# EAGLE design OmneticsAdaptorDoubleHeadstage (EAGLE 7.6.0)
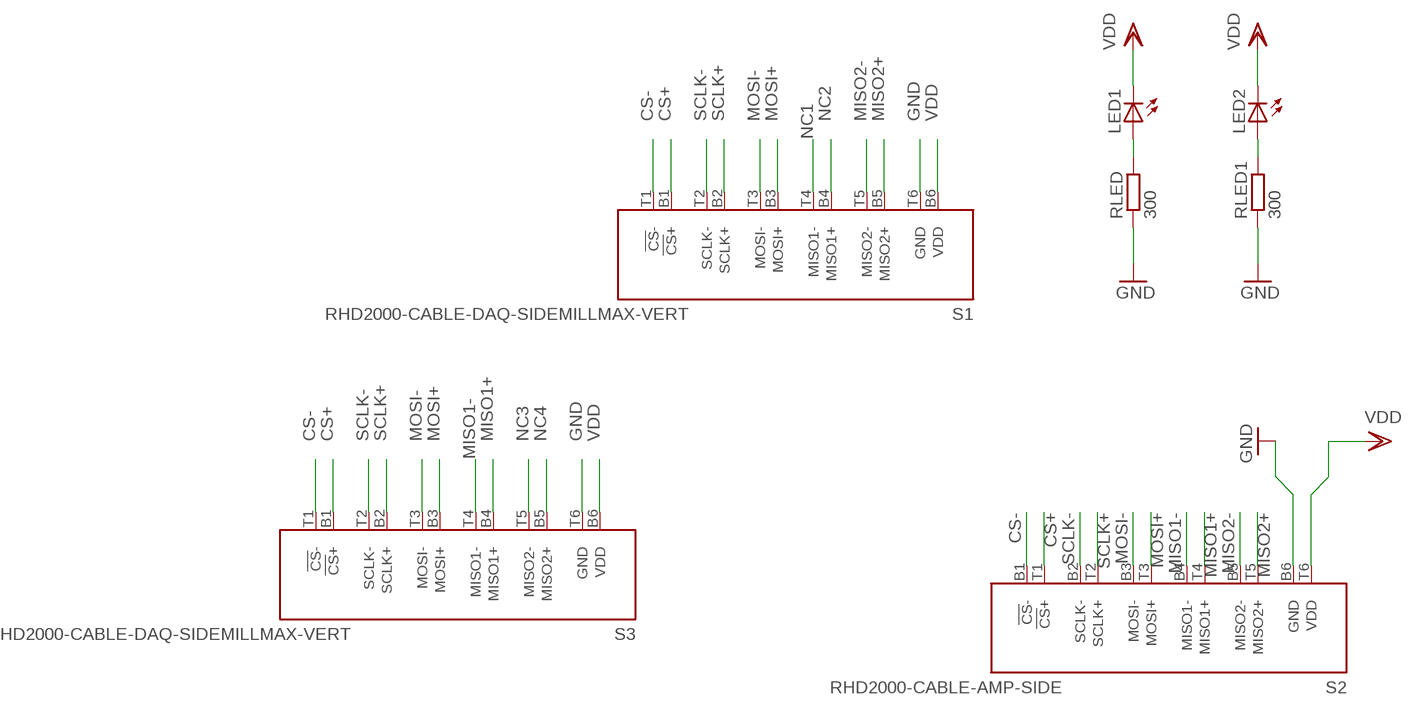
[diagram p0: schematic, sheet 1]

## Parts
LED1  LEDCHIPLED_0805  [CHIPLED_0805]
LED2  LEDCHIPLED_0805  [CHIPLED_0805]
RLED  300  R-EU_R0402  [R0402]
RLED1  300  R-EU_R0402  [R0402]
S1  RHD2000-CABLE-DAQ-SIDEMILLMAX-VERT  [MILLMAX-12PIN-VERT]
S2  RHD2000-CABLE-AMP-SIDE  [OMNETICS_PZN-12-AA]
S3  RHD2000-CABLE-DAQ-SIDEMILLMAX-VERT  [MILLMAX-12PIN-VERT]

## Nets
CS+: S1.B1(!CS!+) S2.T1(!CS!+) S3.B1(!CS!+)
CS-: S1.T1(!CS!-) S2.B1(!CS!-) S3.T1(!CS!-)
GND: RLED1.1 RLED.1 S1.T6(GND) S2.B6(GND) S3.T6(GND)
LEDOUT: LED1.A RLED.2
LEDOUT1: LED2.A RLED1.2
MISO1+: S2.T4(MISO1+) S3.B4(MISO1+)
MISO1-: S2.B4(MISO1-) S3.T4(MISO1-)
MISO2+: S1.B5(MISO2+) S2.T5(MISO2+)
MISO2-: S1.T5(MISO2-) S2.B5(MISO2-)
MOSI+: S1.B3(MOSI+) S2.T3(MOSI+) S3.B3(MOSI+)
MOSI-: S1.T3(MOSI-) S2.B3(MOSI-) S3.T3(MOSI-)
NC1: S1.T4(MISO1-)
NC2: S1.B4(MISO1+)
NC3: S3.T5(MISO2-)
NC4: S3.B5(MISO2+)
SCLK+: S1.B2(SCLK+) S2.T2(SCLK+) S3.B2(SCLK+)
SCLK-: S1.T2(SCLK-) S2.B2(SCLK-) S3.T2(SCLK-)
VDD: LED1.C LED2.C S1.B6(VDD) S2.T6(VDD) S3.B6(VDD)

## Library data of the parts
LED1 LED2 = led:LED: LED OSRAM: - CHIPLED LG R971, LG N971, LY N971, LG Q971, LY Q971, LO R971, LY R971 LH N974, LH R974 LS Q976, LO Q976, LY Q976 LO Q996 - Hyper CHIPLED LW Q18S LB Q993, LB Q99A, LB R99A - SideLED LS A670, LO A670, LY A670, LG A670, LP A670 LB A673, LV A673, LT A673, LW A673 LH A674 LY A675 LS A676, LA A676, LO A676, LY A676, LW A676 LS A679, LY A679, LG A679 - Hyper Micro SIDELED® LS Y876, LA Y876, LO Y876, LY Y876 LT Y87S - SmartLED LW L88C, LW L88S LB L89C, LB L89S, LG L890 LS L89K, LO L89K, LY L89K LS L896, LA L896, LO L896, LY L896 - TOPLED LS T670, LO T670, LY T670, LG T670, LP T670 LSG T670, LSP T670, LSY T670, LOP T670, LYG T670 LG T671, LOG T671, LSG T671 LB T673, LV T673, LT T673, LW T673 LH T674 LS T676, LA T676, LO T676, LY T676, LB T676, LH T676, LSB T676, LW T676 LB T67C, LV T67C, LT T67C, LS T67K, LO T67K, LY T67K, LW E67C LS E67B, LA E67B, LO E67B, LY E67B, LB E67C, LV E67C, LT E67C LW T67C LS T679, LY T679, LG T679 LS T770, LO T770, LY T770, LG T770, LP T770 LB T773, LV T773, LT T773, LW T773 LH T774 LS E675, LA E675, LY E675, LS T675 LS T776, LA T776, LO T776, LY T776, LB T776 LHGB T686 LT T68C, LB T68C - Hyper Mini TOPLED® LB M676 - Mini TOPLED Santana® LG M470 LS M47K, LO M47K, LY M47K Source: http://www.osram.convergy.de LUXEON: - LUMILED® LXK2-PW12-R00, LXK2-PW12-S00, LXK2-PW14-U00, LXK2-PW14-V00 LXK2-PM12-R00, LXK2-PM12-S00, LXK2-PM14-U00 LXK2-PE12-Q00, LXK2-PE12-R00, LXK2-PE12-S00, LXK2-PE14-T00, LXK2-PE14-U00 LXK2-PB12-K00, LXK2-PB12-L00, LXK2-PB12-M00, LXK2-PB14-N00, LXK2-PB14-P00, LXK2-PB14-Q00 LXK2-PR12-L00, LXK2-PR12-M00, LXK2-PR14-Q00, LXK2-PR14-R00 LXK2-PD12-Q00, LXK2-PD12-R00, LXK2-PD12-S00 LXK2-PH12-R00, LXK2-PH12-S00 LXK2-PL12-P00, LXK2-PL12-Q00, LXK2-PL12-R00 Source: www.luxeon.com KINGBRIGHT: KA-3528ASYC Source: www.kingbright.com
RLED RLED1 = resistor:R-EU_: RESISTOR, European symbol
S1 S3 = RHD2000:RHD2000-CABLE-DAQ-SIDE: Omnetics A79623 PZN-12-AA connector for SPI interface (controller side)
S2 = headstage:RHD2000-CABLE-AMP-SIDE

## Board
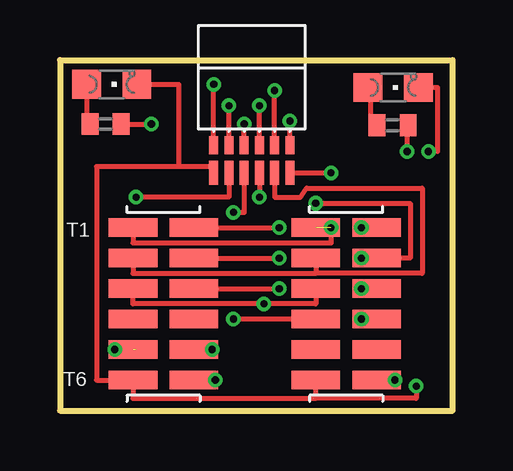
[diagram p1: board, top side]
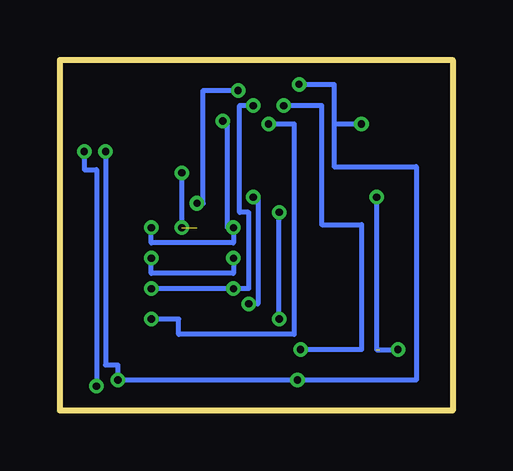
[diagram p2: board, bottom side, seen from below]

Size 16.38 x 14.61 mm. Coordinates in mm from the lower left corner, seen from the top.
Outline: 0,14.61 0,0 16.38,0 16.38,14.61 0,14.61
Copper layers (1*16): Top 0.035mm / dielectric 1.5mm / Bottom 0.035mm
Design rules "Fusion_eagle_rule_v1.1 *": minimum track width 6mil, minimum drill 0.3mm, track to track 6mil, track to pad 6mil, pad to pad 6mil, via to via 6mil, smd to smd 0mil, copper to edge 10mil, drill to drill 10mil, minimum pad ring 10mil, minimum via ring 6mil, stop-mask expansion 2mil, vias tented up to drill 100mil, thermal gap 10mil

### Footprints (pad centres in the part's own frame; a part is rotated, then mirrored left to right if it is on the bottom)
CHIPLED_0805 = smd 1.2 x 1.2: A 0,-1.05; C 0,1.05
R0402 = smd 0.7 x 0.9: 1 -0.65,0; 2 0.65,0
MILLMAX-12PIN-VERT = smd 0.762 x 2.032: B1 3.175,1.27; B2 1.905,1.27; B3 0.635,1.27; B4 -0.635,1.27; B5 -1.905,1.27; B6 -3.175,1.27; T1 3.175,-1.27; T2 1.905,-1.27; T3 0.635,-1.27; T4 -0.635,-1.27; T5 -1.905,-1.27; T6 -3.175,-1.27
OMNETICS_PZN-12-AA = smd 0.381 x 0.762: B1 1.587,-1.016; B2 0.953,-1.016; B3 0.318,-1.016; B4 -0.318,-1.016; B5 -0.953,-1.016; B6 -1.587,-1.016 | smd 0.381 x 1.016: T1 1.587,-2.159; T2 0.953,-2.159; T3 0.318,-2.159; T4 -0.318,-2.159; T5 -0.953,-2.159; T6 -1.587,-2.159

### Placement (x,y rotation side)
LED1  13.89,13.46 270 top
LED2  2.16,13.59 270 top
RLED  13.87,11.89 180 top
RLED1  1.91,11.94 180 top
S1  4.32,4.45 90 top
S2  8,12.06 0 top
S3  11.94,4.45 90 top

### Tracks (layer width: path | path; a pad name or v marks a point on that pad's centre or on a via)
CS+  (via drill 0.3)  (1 unrouted)
  Top 0.203: S1.B1 3.05,6.99 11.3,6.99 v11.3,7.62 | S2.T1 v11.3,9.91
  Bottom 0.203: v11.3,9.91 v11.3,7.62
CS-  (via drill 0.3)
  Top 0.203: S1.T1 v9.14,7.62 | v12.57,7.62 S3.T1 | S2.B1 v9.59,12.06
  Bottom 0.203: v12.57,7.62 12.57,6.99 9.14,6.99 v9.14,7.62 9.4,7.62 9.4,12.06 v9.59,12.06
GND  (via drill 0.3)
  Top 0.203: RLED1.1 v3.81,11.94 | S1.T6 v6.48,1.27 | v13.97,1.27 S3.T6 | RLED.1 14.48,11.89 v14.48,10.79 | S2.B6 v6.41,13.59
  Bottom 0.203: v3.81,11.94 4.95,11.94 | 4.95,11.94 4.95,10.16 1.52,10.16 1.52,1.27 v6.48,1.27 v13.97,1.27 13.97,1.91 14.48,1.91 v14.48,10.79 | v6.41,13.59 4.95,13.59 4.95,11.94
LEDOUT
  Top 0.203: LED1.A 12.95,13.46 12.95,11.89 RLED.2
LEDOUT1
  Top 0.203: LED2.A 1.11,11.94 RLED1.2
MISO1+  (via drill 0.3)
  Top 0.203: S2.T4 7.68,8.26 v7.24,8.26 | S3.B4 v7.24,3.81
  Bottom 0.203: v7.24,3.81 v7.24,8.26
MISO1-  (via drill 0.3)
  Top 0.203: v12.57,3.81 S3.T4 | S2.B4 v7.68,11.94
  Bottom 0.203: v12.57,3.81 11.43,3.81 11.43,3.17 6.6,3.17 6.6,11.94 v7.68,11.94
MISO2+  (via drill 0.3)  (1 unrouted)
  Top 0.203: S2.T5 7.05,8.89 v3.17,8.89
  Bottom 0.203: v2.29,2.54 3.17,2.54 v3.17,8.89
MISO2-  (via drill 0.3)
  Top 0.203: S1.T5 v6.35,2.54 | S2.B5 v7.05,12.7
  Bottom 0.203: v6.35,2.54 3.81,2.54 3.81,7.75 5.46,7.75 5.46,12.7 v7.05,12.7
MOSI+  (via drill 0.3)
  Top 0.203: S3.B3 10.67,4.45 v8.51,4.45 3.05,4.45 S1.B3 | S2.T3 v8.32,8.89
  Bottom 0.203: v8.51,4.45 8.13,4.45 8.13,8.89 v8.32,8.89
MOSI-  (via drill 0.3)
  Top 0.203: S1.T3 v9.14,5.08 | v12.57,5.08 S3.T3 | S2.B3 v8.32,12.7
  Bottom 0.203: v12.57,5.08 v9.14,5.08 8.51,5.08 8.51,8.26 8.89,8.26 8.89,12.7 v8.32,12.7
NC3
  Top 0.203: 13.97,2.54 S3.T5
SCLK+
  Top 0.203: S1.B2 3.05,5.71 10.67,5.71 | S3.B2 10.67,5.71 | 10.67,5.71 15.11,5.71 15.11,9.27 10.29,9.27 10.03,8.89 8.95,8.89 S2.T2
SCLK-  (via drill 0.3)
  Top 0.203: S1.T2 v9.14,6.35 | S3.T2 v12.57,6.35 14.61,6.35 14.61,8.64 v10.67,8.64 | S2.B2 v8.95,13.34
  Bottom 0.203: v9.14,6.35 9.14,5.71 12.57,5.71 v12.57,6.35 | v10.67,8.64 10.41,8.64 10.41,13.34 v8.95,13.34
VDD  (via drill 0.3)
  Top 0.203: LED2.C 4.95,13.59 4.95,10.16 | 10.67,0.51 3.05,0.51 S1.B6 1.52,1.27 1.52,10.16 4.95,10.16 | 10.67,0.51 S3.B6 | LED1.C 15.75,13.46 15.75,10.79 v15.37,10.79 | v14.86,1.02 14.86,0.51 10.67,0.51 | S2.T6 6.41,10.16 4.95,10.16
  Bottom 0.203: v15.37,10.79 15.37,10.03 14.86,10.03 v14.86,1.02

### Text on the board
tNames: T1 | T6